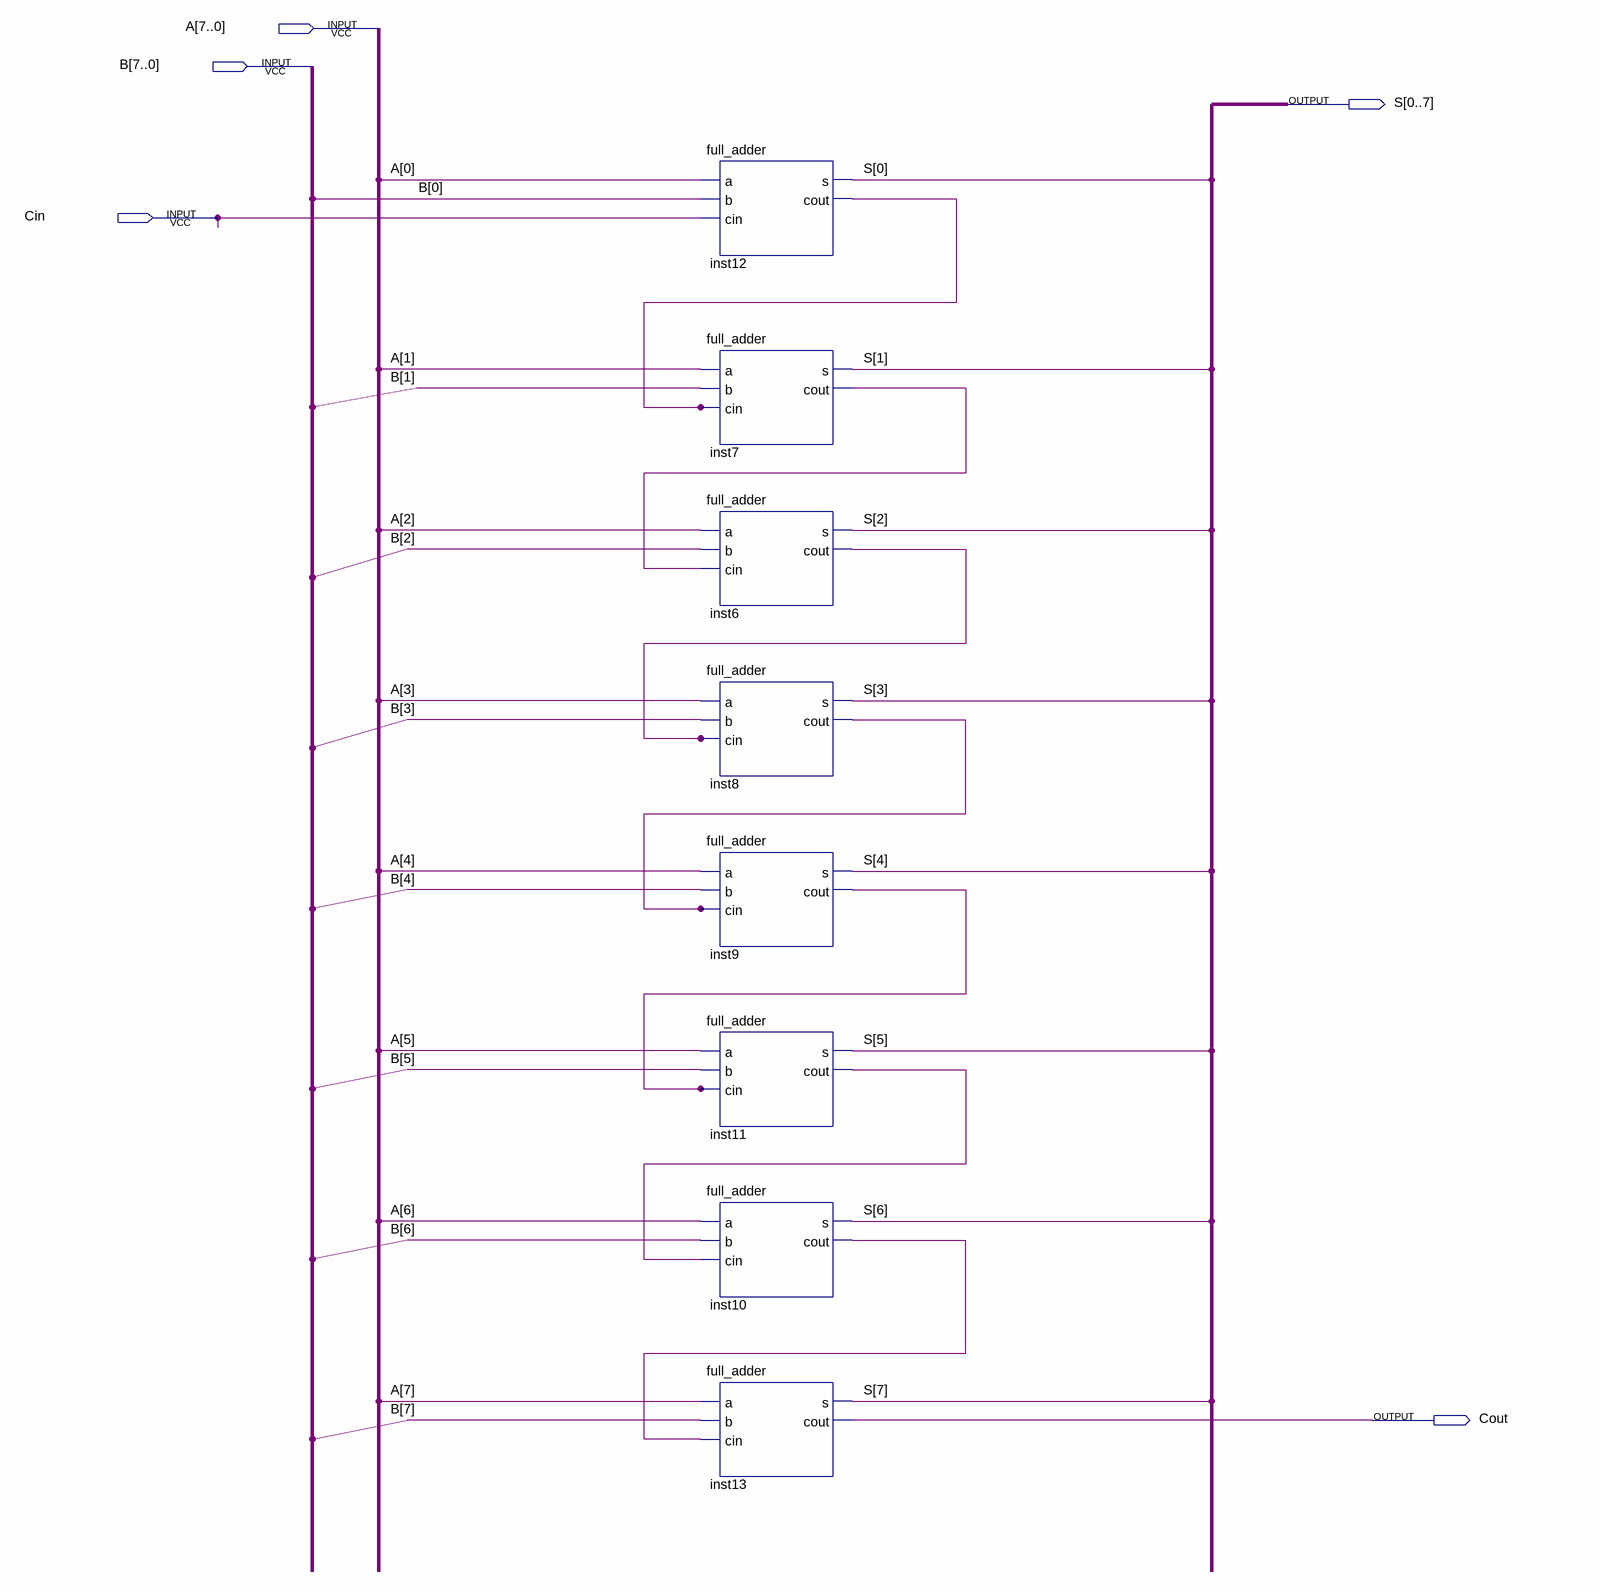
[diagram p0: schematic sheet]
// Quartus schematic full_adder8bits.bdf as structural Verilog: 8 symbols, 5 pins
module full_adder8bits (
  input  [7:0] A,
  input  [7:0] B,
  input  Cin,
  output [0:7] S,
  output Cout
);

  wire inst6_cout, inst7_cout, inst8_cout, inst9_cout, inst10_cout, inst11_cout, inst12_cout;

  full_adder inst12 (.a(A[0]), .b(B[0]), .cin(Cin), .s(S[0]), .cout(inst12_cout));
  full_adder inst7 (.a(A[1]), .b(B[1]), .cin(inst12_cout), .s(S[1]), .cout(inst7_cout));
  full_adder inst6 (.a(A[2]), .b(B[2]), .cin(inst7_cout), .s(S[2]), .cout(inst6_cout));
  full_adder inst8 (.a(A[3]), .b(B[3]), .cin(inst6_cout), .s(S[3]), .cout(inst8_cout));
  full_adder inst9 (.a(A[4]), .b(B[4]), .cin(inst8_cout), .s(S[4]), .cout(inst9_cout));
  full_adder inst11 (.a(A[5]), .b(B[5]), .cin(inst9_cout), .s(S[5]), .cout(inst11_cout));
  full_adder inst10 (.a(A[6]), .b(B[6]), .cin(inst11_cout), .s(S[6]), .cout(inst10_cout));
  full_adder inst13 (.a(A[7]), .b(B[7]), .cin(inst10_cout), .s(S[7]), .cout(Cout));
endmodule
